# EasyEDA schematic table4_vd2.json
TITLE: Sheet_1; REV: 1.0; Date: 2020-10-19; Sheet: 1/1; Drawn By: barisayyildiz; Company: Your Company
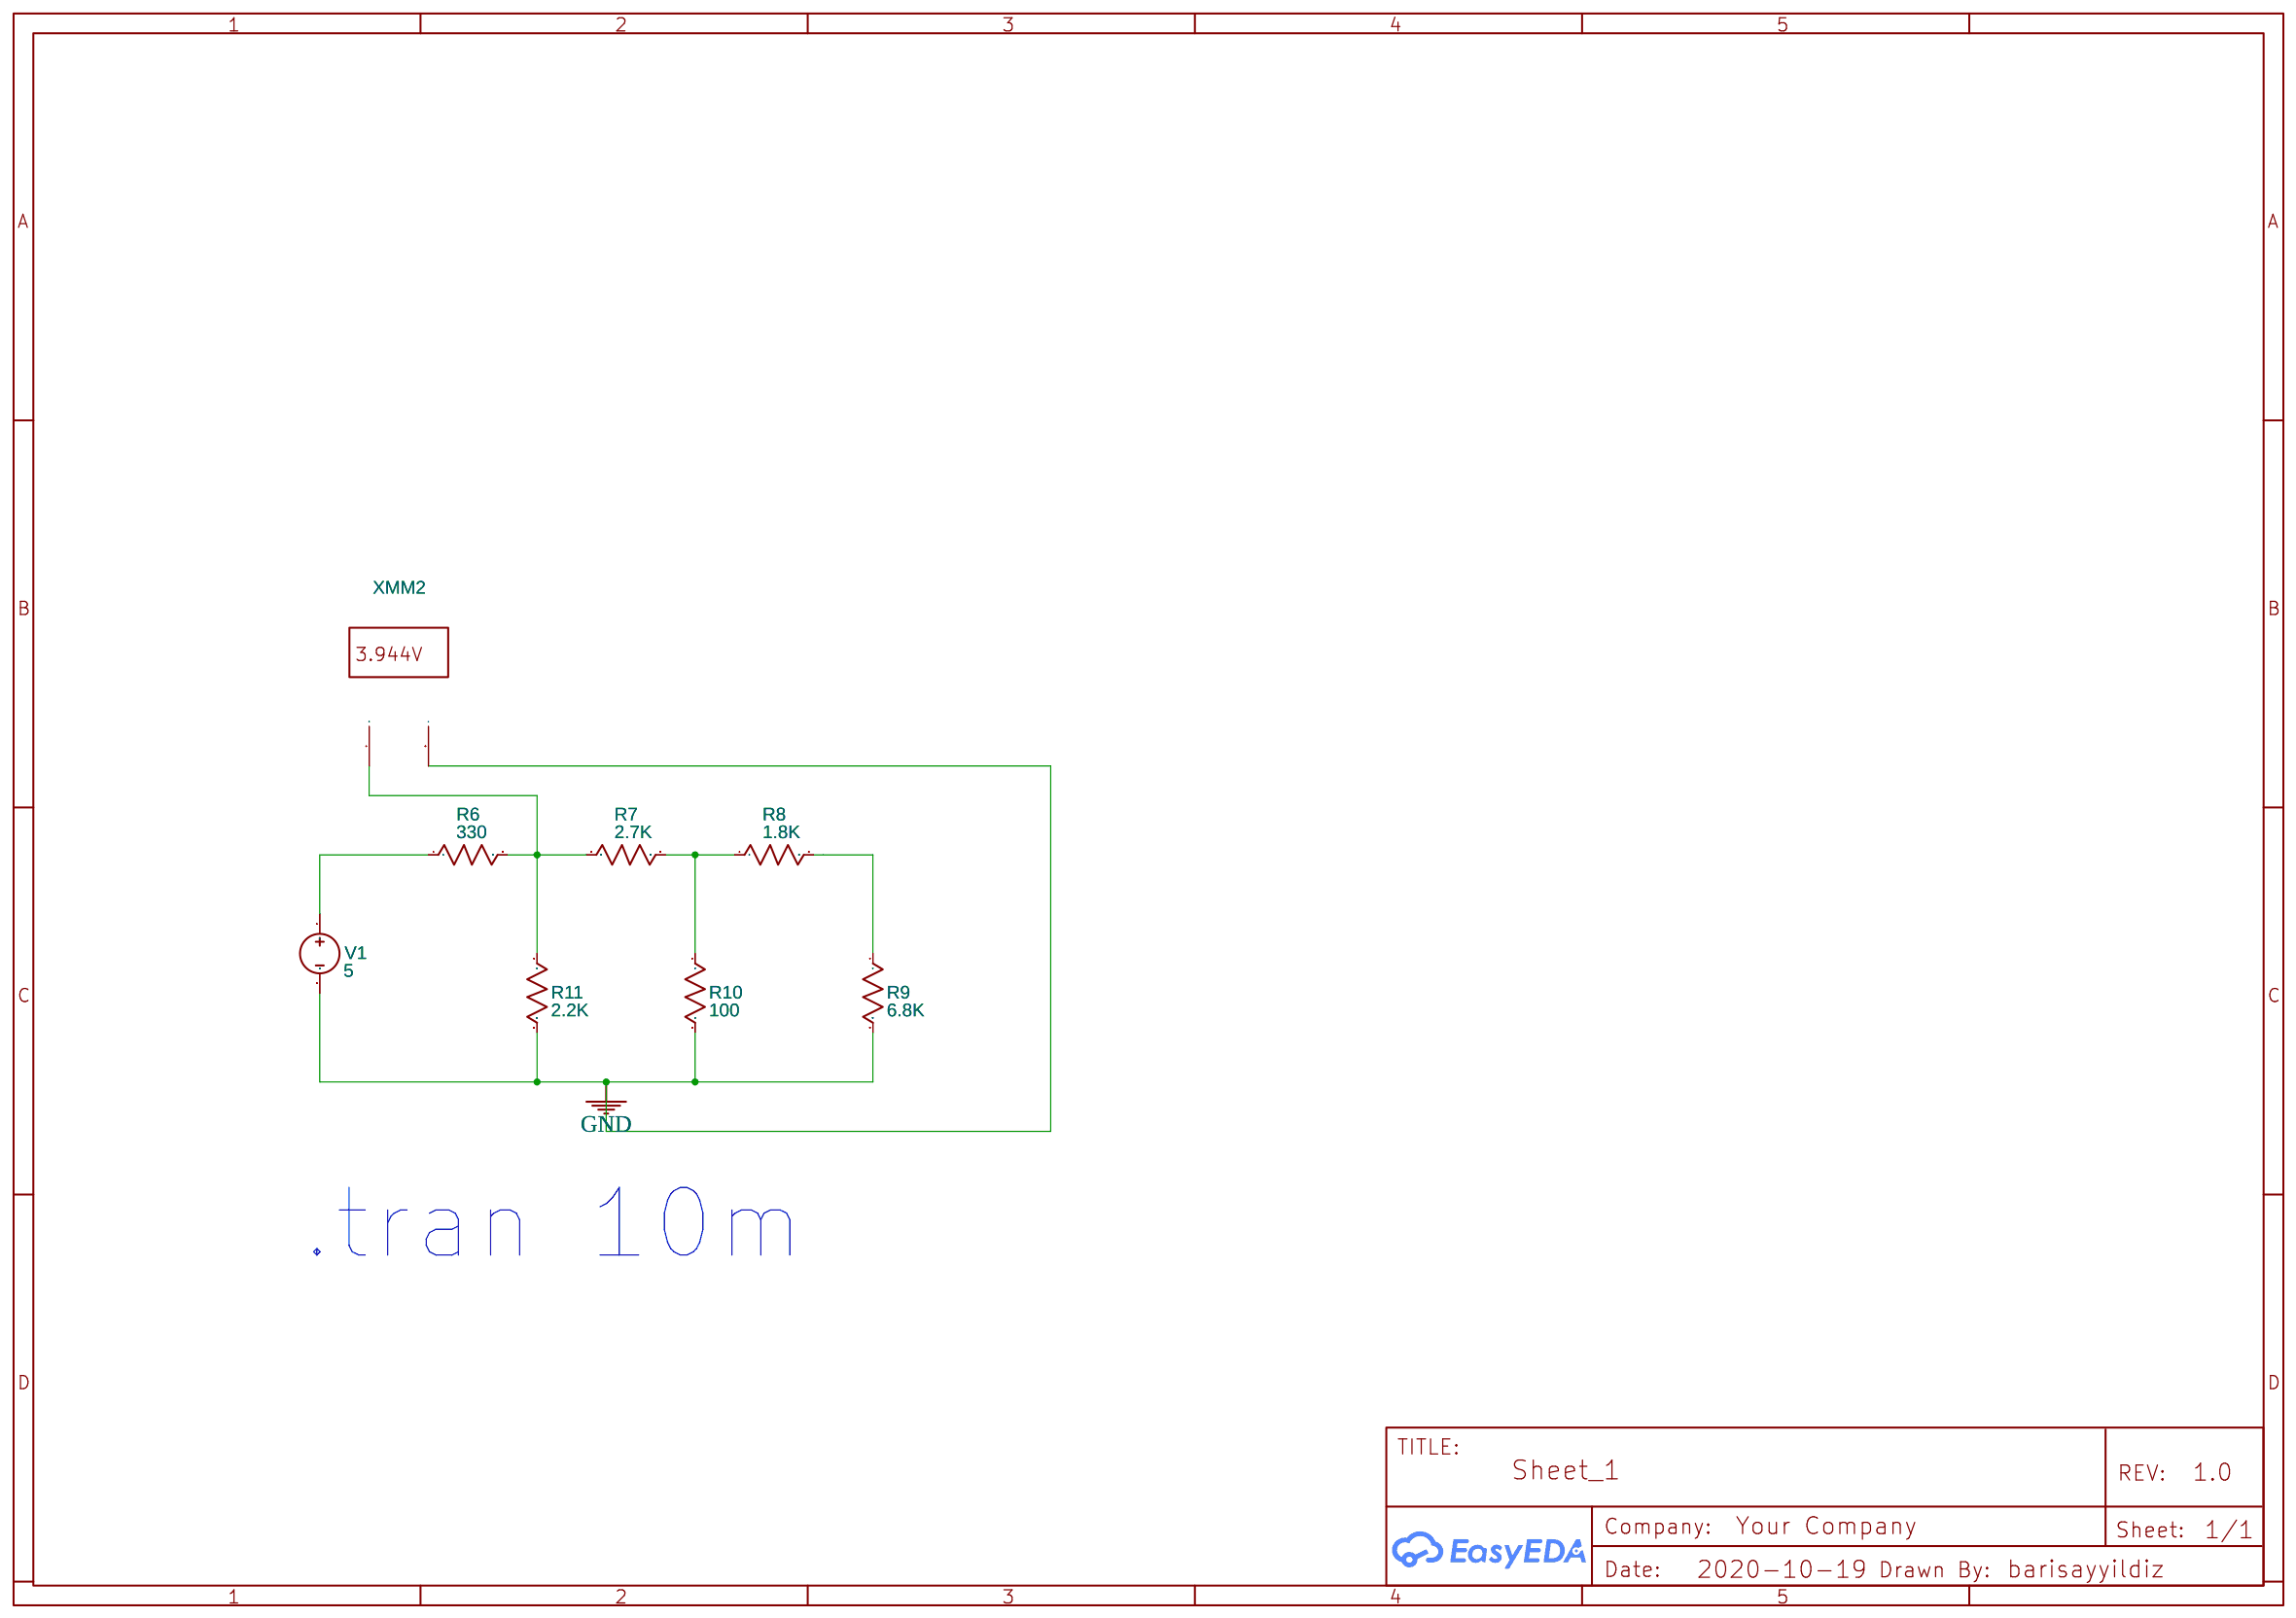
[diagram p0: schematic sheet]

## Parts
R6  330  [AXIAL-0.3]
R7  2.7K  [AXIAL-0.3]
R8  1.8K  [AXIAL-0.3]
R9  6.8K  [AXIAL-0.3]
R10  100  [AXIAL-0.3]
R11  2.2K  [AXIAL-0.3]
V1  5  [HDR1X2]
XMM2  Multimeter

## Library data of the parts
R6-R11 = Resistor_US: Resistance: 1k; Contributor: EasyEDA; Supplier: YUJING
V1 = VDC: Contributor: EasyEDA; sim: true
XMM2 = MULTIMETER: Supplier: LCSC; Multimeter Type: Voltmeter; Power Type: AC; Voltmeter resistance: 10μ; Ammeter resistance: 1G; NameDisplay: 0; Contributor: EasyEDA; sim: true

## Nets
GND: R9.2 R10.2 R11.2 V1.2 XMM2.2(I)
Net-(R6-1): R6.1 V1.1
Net-(R6-2): R6.2 R7.1 R11.1 XMM2.1(+)
Net-(R7-2): R7.2 R8.1 R10.1
Net-(R8-2): R8.2 R9.1

## Notes on the sheet
- .tran 10m
